# EAGLE design TP4056mCH (EAGLE 7.4.0)
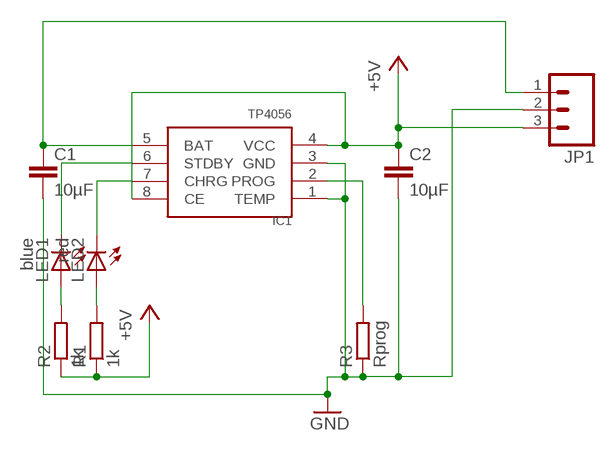
[diagram p0: schematic, sheet 1]

## Parts
C1  10µF  C-EUC0805  [C0805]
C2  10µF  C-EUC0805  [C0805]
IC1  TP4056  [SOP-8]
JP1  M03PTH  [1X03]
LED1  blue  LEDCHIP-LED0805  [CHIP-LED0805]
LED2  red  LEDCHIP-LED0805  [CHIP-LED0805]
R1  1k  R-EU_R0603  [R0603]
R2  1k  R-EU_R0603  [R0603]
R3  Rprog  R-EU_R0603  [R0603]

## Nets
+5V: C2.1 IC1.4(VCC) IC1.8(CE) JP1.3 R1.1 R2.1
GND: C1.2 C2.2 IC1.1(TEMP) IC1.3(GND) JP1.2 R3.1
N$1: IC1.2(PROG) R3.2
N$2: C1.1 IC1.5(BAT) JP1.1
N$3: IC1.6(STDBY) LED1.C
N$4: IC1.7(CHRG) LED2.C
N$5: LED1.A R2.2
N$6: LED2.A R1.2

## Library data of the parts
C1 C2 = rcl:C-EU: CAPACITOR, European symbol
IC1 = TP4056:TP4056
JP1 = SparkFun-Connectors:M03: Header 3 Standard 3-pin 0.1" header. Use with straight break away headers (SKU : PRT-00116), right angle break away headers (PRT-00553), swiss pins (PRT-00743), machine pins (PRT-00117), and female headers (PRT-00115). Molex polarized connector foot print use with SKU : PRT-08232 with associated crimp pins and housings.
LED1 LED2 = adafruit:LED: LED OSRAM: - CHIPLED LG R971, LG N971, LY N971, LG Q971, LY Q971, LO R971, LY R971 LH N974, LH R974 LS Q976, LO Q976, LY Q976 LO Q996 - Hyper CHIPLED LW Q18S LB Q993, LB Q99A, LB R99A - SideLED LS A670, LO A670, LY A670, LG A670, LP A670 LB A673, LV A673, LT A673, LW A673 LH A674 LY A675 LS A676, LA A676, LO A676, LY A676, LW A676 LS A679, LY A679, LG A679 - Hyper Micro SIDELED® LS Y876, LA Y876, LO Y876, LY Y876 LT Y87S - SmartLED LW L88C, LW L88S LB L89C, LB L89S, LG L890 LS L89K, LO L89K, LY L89K LS L896, LA L896, LO L896, LY L896 - TOPLED LS T670, LO T670, LY T670, LG T670, LP T670 LSG T670, LSP T670, LSY T670, LOP T670, LYG T670 LG T671, LOG T671, LSG T671 LB T673, LV T673, LT T673, LW T673 LH T674 LS T676, LA T676, LO T676, LY T676, LB T676, LH T676, LSB T676, LW T676 LB T67C, LV T67C, LT T67C, LS T67K, LO T67K, LY T67K, LW E67C LS E67B, LA E67B, LO E67B, LY E67B, LB E67C, LV E67C, LT E67C LW T67C LS T679, LY T679, LG T679 LS T770, LO T770, LY T770, LG T770, LP T770 LB T773, LV T773, LT T773, LW T773 LH T774 LS E675, LA E675, LY E675, LS T675 LS T776, LA T776, LO T776, LY T776, LB T776 LHGB T686 LT T68C, LB T68C - Hyper Mini TOPLED® LB M676 - Mini TOPLED Santana® LG M470 LS M47K, LO M47K, LY M47K Source: http://www.osram.convergy.de/
R1-R3 = rcl:R-EU_: RESISTOR, European symbol

## Board
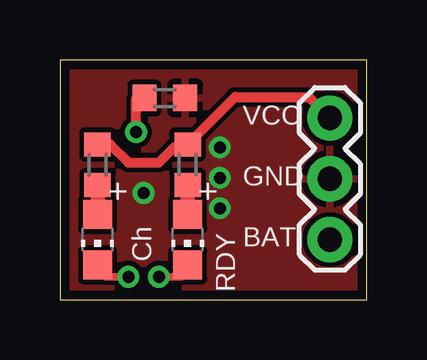
[diagram p1: board, top side]
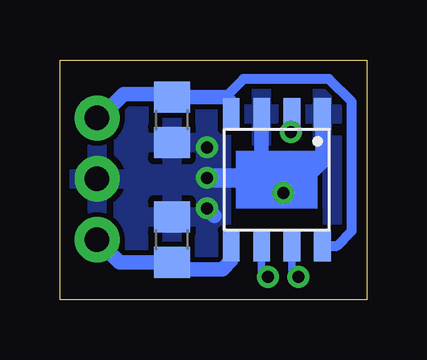
[diagram p2: board, bottom side, seen from below]

Size 12.81 x 10 mm. Coordinates in mm from the lower left corner, seen from the top.
Outline: 0,0 12.81,0 12.81,10 0,10 0,0
Copper layers (1*16): Top 0.035mm / dielectric 1.5mm / Bottom 0.035mm
Design rules "default *": minimum track width 10mil, minimum drill 24mil, track to track 8mil, track to pad 8mil, pad to pad 8mil, via to via 8mil, smd to smd 8mil, copper to edge 15mil, drill to drill 8mil, minimum pad ring 10mil, minimum via ring 8mil, stop-mask expansion 4mil, vias tented up to drill 20mil, thermal gap 10mil

### Footprints (pad centres in the part's own frame; a part is rotated, then mirrored left to right if it is on the bottom)
C0805 = smd 1.3 x 1.5: 1 -0.95,0; 2 0.95,0
SOP-8 = smd 1.3 x 0.7: 1 -2.75,1.905; 2 -2.75,0.635; 3 -2.75,-0.635; 4 -2.75,-1.905; 5 2.75,-1.905; 6 2.75,-0.635; 7 2.75,0.635; 8 2.75,1.905
1X03 = drill 1.016 pad 1.88: 1 0,0; 2 2.54,0; 3 5.08,0
CHIP-LED0805 = smd 1.2 x 1.2: A 0,-1.05; C 0,1.05
R0603 = smd 1 x 1.1: 1 -0.85,0; 2 0.85,0

### Placement (x,y rotation side)
C1  8.13,2.5 90 bottom
C2  8.13,7.5 270 bottom
IC1  3.76,5 270 bottom
JP1  11.26,2.5 90 top
LED1  5.33,2.5 180 top
LED2  1.57,2.5 180 top
R1  1.57,5.62 270 top
R2  5.33,5.62 270 top
R3  4.38,8.41 180 top

### Tracks (layer width: path | path; a pad name or v marks a point on that pad's centre or on a via)
+5V
  Top 0.406: R1.1 2.1,6.47 2.86,5.71 4.13,5.71 4.76,6.35 5.2,6.35 R2.1 7.3,8.45 10.39,8.45 JP1.3
  Bottom 0.406: IC1.8 1.24,2.25 0.64,2.86 0.64,8.26 1.59,9.21 5.15,9.21 5.91,8.45
  Bottom 0.61: JP1.3 11.15,7.58 10.16,8.57 8.26,8.57 C2.1 5.91,8.45 5.71,8.26 5.71,7.8 IC1.4
GND  (via drill 0.5)
  Bottom 0.61: IC1.1 1.85,5.76 2.54,5.08 4.45,5.08 | 4.45,5.08 5.4,5.08 | 6.35,3.49 v6.67,3.81 | IC1.3 4.39,5.13 4.45,5.08
  Bottom 0.813: 5.4,5.08 v6.67,5.08
  other vias: 6.67,6.35 3.49,4.45
  pour Top: -1.27,11.43 -1.27,-1.27 15.24,-1.27 15.24,2.22 15.24,11.43
  pour Bottom: -0.32,10.48 -0.32,-0.32 14.29,-0.32 14.29,10.48
N$1  (via drill 0.5)
  Top 0.406: v3.17,6.99 3.17,8.38 R3.2
  Bottom 0.406: IC1.2 3.12,7.04 v3.17,6.99
N$2
  Bottom 0.61: IC1.5 5.67,1.64 6.03,1.27 7.85,1.27 C1.1 10.31,1.55 JP1.1
N$3  (via drill 0.5)
  Top 0.305: v4.13,0.95 5.08,0.95 5.08,1.38 LED1.C
  Bottom 0.305: IC1.6 4.39,0.9 v4.13,0.95
N$4  (via drill 0.5)
  Top 0.305: v2.86,0.95 1.91,0.95 1.91,1.43 LED2.C
  Bottom 0.305: IC1.7 3.12,0.9 v2.86,0.95
N$5
  Top 0.61: LED1.A R2.2
N$6
  Top 0.61: LED2.A R1.2

### Text on the board
tPlace: VCC | GND | Ch | BAT | RDY